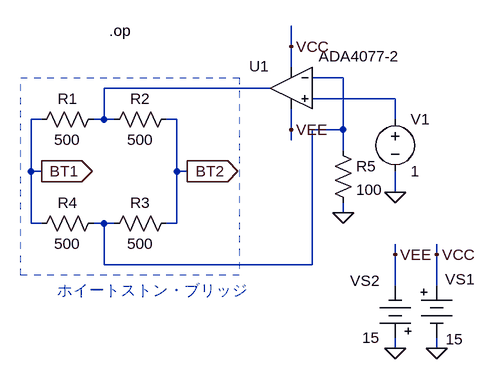
[diagram p0: schematic fig-01-02-33.asc]
fig-01-02-33.asc, the LTspice schematic file:
Version 4
SHEET 1 880 680
WIRE 224 -32 224 -64
WIRE 224 0 224 -32
WIRE 304 16 256 16
WIRE 192 32 -64 32
WIRE 384 48 256 48
WIRE -160 80 -176 80
WIRE -64 80 -64 32
WIRE -64 80 -80 80
WIRE -48 80 -64 80
WIRE 48 80 32 80
WIRE 384 80 384 48
WIRE 224 96 224 64
WIRE 304 96 304 16
WIRE 304 96 256 96
WIRE 224 112 224 96
WIRE 304 128 304 96
WIRE -176 160 -176 80
WIRE -160 160 -176 160
WIRE 48 160 48 80
WIRE 64 160 48 160
WIRE 384 192 384 160
WIRE 304 224 304 208
WIRE -176 240 -176 160
WIRE -160 240 -176 240
WIRE -64 240 -80 240
WIRE -48 240 -64 240
WIRE 48 240 48 160
WIRE 48 240 32 240
WIRE 384 288 384 272
WIRE 448 288 448 272
WIRE -64 304 -64 240
WIRE 256 304 256 96
WIRE 256 304 -64 304
WIRE 384 336 384 288
WIRE 448 336 448 288
WIRE 384 432 384 416
WIRE 448 432 448 416
FLAG 384 192 0
FLAG 384 432 0
FLAG 448 432 0
FLAG 384 288 VEE
FLAG 448 288 VCC
FLAG 224 -32 VCC
FLAG 224 96 VEE
FLAG 304 224 0
FLAG -160 160 BT1
IOPIN -160 160 Out
FLAG 64 160 BT2
IOPIN 64 160 Out
SYMBOL Misc\\battery 448 320 R0
WINDOW 0 13 6 Left 2
WINDOW 3 14 98 Left 2
SYMATTR InstName VS1
SYMATTR Value 15
SYMBOL Misc\\battery 384 432 R180
WINDOW 0 24 104 Left 2
WINDOW 3 24 16 Left 2
SYMATTR InstName VS2
SYMATTR Value 15
SYMBOL res 48 64 R90
WINDOW 0 0 56 VBottom 2
WINDOW 3 32 56 VTop 2
SYMATTR InstName R2
SYMATTR Value 500
SYMBOL res -64 64 R90
WINDOW 0 0 56 VBottom 2
WINDOW 3 32 56 VTop 2
SYMATTR InstName R1
SYMATTR Value 500
SYMBOL voltage 384 64 R0
WINDOW 123 0 0 Left 0
WINDOW 39 0 0 Left 0
SYMATTR InstName V1
SYMATTR Value 1
SYMBOL Opamps\\ADA4077-2 224 -32 M0
WINDOW 0 34 30 Left 2
WINDOW 3 -167 15 Left 2
SYMATTR InstName U1
SYMBOL res 48 224 R90
WINDOW 0 0 56 VBottom 2
WINDOW 3 32 56 VTop 2
SYMATTR InstName R3
SYMATTR Value 500
SYMBOL res -64 224 R90
WINDOW 0 0 56 VBottom 2
WINDOW 3 32 56 VTop 2
SYMATTR InstName R4
SYMATTR Value 500
SYMBOL res 288 112 R0
SYMATTR InstName R5
SYMATTR Value 100
TEXT -56 -56 Left 2 !.op
TEXT -136 344 Left 2 ;ホイートストン・ブリッジ
RECTANGLE Normal 144 320 -192 16 2

The netlist it stands for:
* fig-01-02-33.asc
VS1 VCC 0 15
VS2 0 VEE 15
R2 BT2 N002 500
R1 N002 BT1 500
V1 N003 0 1
XU1 N003 N001 VCC VEE N002 ADA4077-2  ; pins In+ In- V+ V- OUT
R3 BT2 N001 500
R4 N001 BT1 500
R5 N001 0 100
.op
* ホイートストン・ブリッジ
.backanno
.end